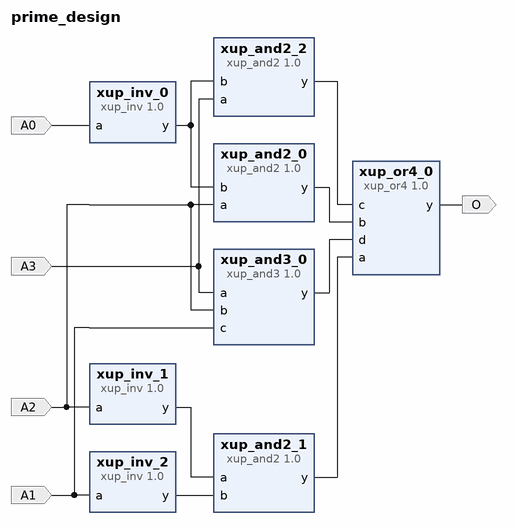
[diagram p0: block diagram of the top level]
# Vivado block design prime_design, xc7vx485tffg1157-1, Vivado 2019.2
create_bd_design prime_design

create_bd_port -dir I A3
create_bd_port -dir I A2
create_bd_port -dir I A1
create_bd_port -dir I A0
create_bd_port -dir O O

create_bd_cell -type ip -vlnv xilinx.com:XUP:xup_and2:1.0 xup_and2_0
create_bd_cell -type ip -vlnv xilinx.com:XUP:xup_and2:1.0 xup_and2_1
create_bd_cell -type ip -vlnv xilinx.com:XUP:xup_and2:1.0 xup_and2_2
create_bd_cell -type ip -vlnv xilinx.com:XUP:xup_and3:1.0 xup_and3_0
create_bd_cell -type ip -vlnv xilinx.com:XUP:xup_inv:1.0 xup_inv_0
create_bd_cell -type ip -vlnv xilinx.com:XUP:xup_inv:1.0 xup_inv_1
create_bd_cell -type ip -vlnv xilinx.com:XUP:xup_inv:1.0 xup_inv_2
create_bd_cell -type ip -vlnv xilinx.com:XUP:xup_or4:1.0 xup_or4_0

# ---- connections ----

connect_bd_net -net A2_1 [get_bd_ports A2] [get_bd_pins xup_inv_1/a] [get_bd_pins xup_and2_0/a] [get_bd_pins xup_and3_0/b]
connect_bd_net [get_bd_pins xup_inv_1/y] [get_bd_pins xup_and2_1/a]
connect_bd_net -net A1_1 [get_bd_ports A1] [get_bd_pins xup_inv_2/a] [get_bd_pins xup_and3_0/c]
connect_bd_net [get_bd_pins xup_inv_2/y] [get_bd_pins xup_and2_1/b]
connect_bd_net [get_bd_pins xup_and2_1/y] [get_bd_pins xup_or4_0/a]
connect_bd_net [get_bd_pins xup_and2_0/y] [get_bd_pins xup_or4_0/b]
connect_bd_net [get_bd_pins xup_and2_2/y] [get_bd_pins xup_or4_0/c]
connect_bd_net [get_bd_pins xup_and3_0/y] [get_bd_pins xup_or4_0/d]
connect_bd_net -net A0_1 [get_bd_ports A0] [get_bd_pins xup_inv_0/a]
connect_bd_net [get_bd_pins xup_inv_0/y] [get_bd_pins xup_and2_0/b] [get_bd_pins xup_and2_2/b]
connect_bd_net -net A3_1 [get_bd_ports A3] [get_bd_pins xup_and2_2/a] [get_bd_pins xup_and3_0/a]
connect_bd_net [get_bd_pins xup_or4_0/y] [get_bd_ports O]

validate_bd_design
save_bd_design
